# EAGLE schematic sous-vide-shield (EAGLE 7.6.0)
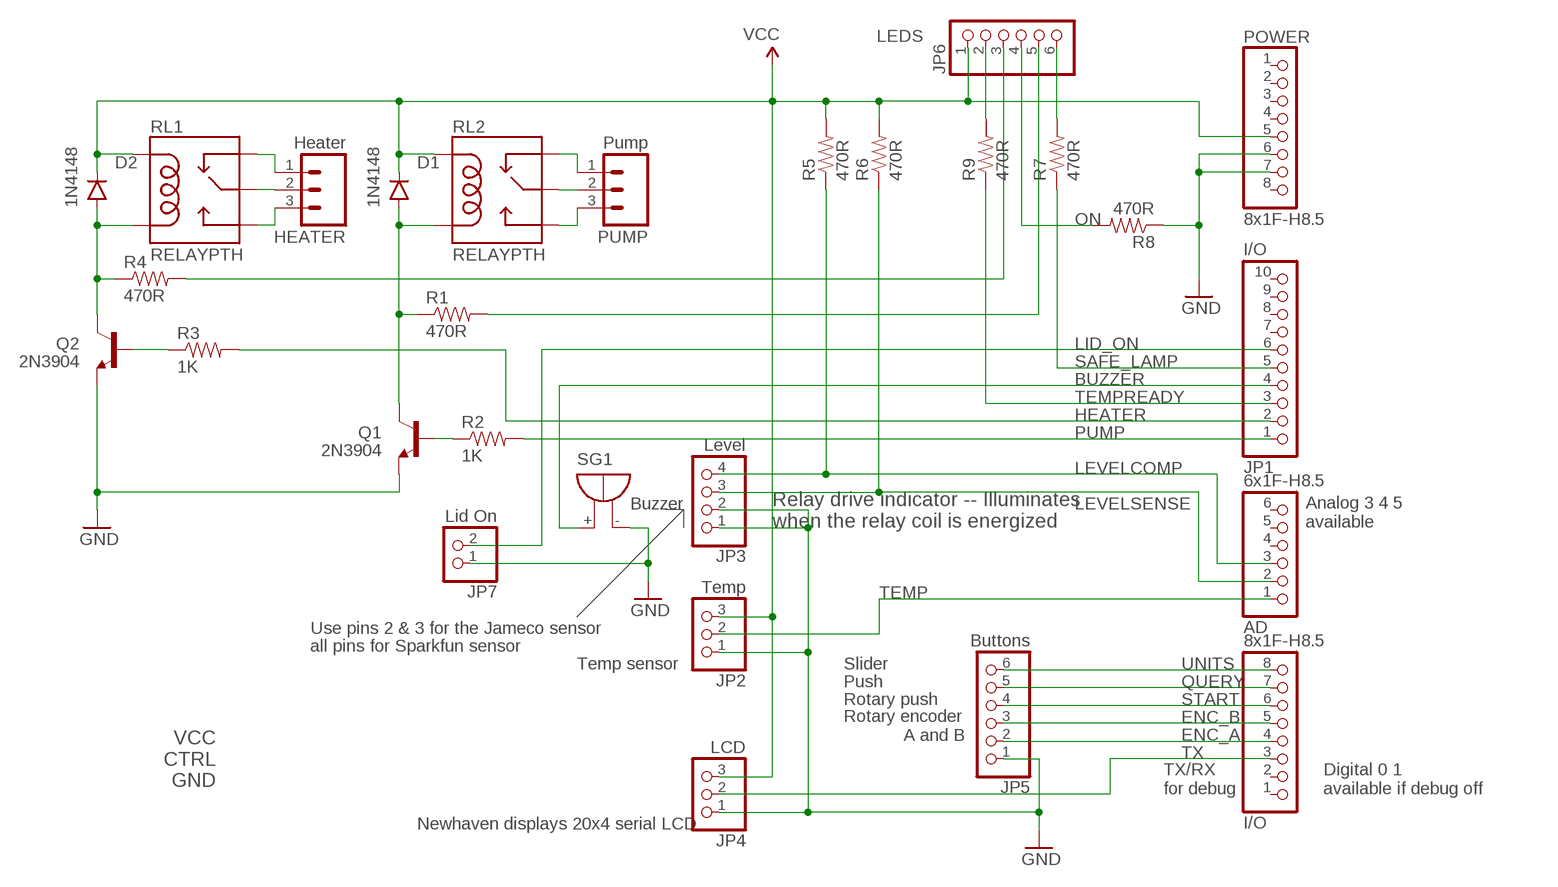
[diagram p0: schematic, sheet 1]

## Parts
AD  6x1F-H8.5  PINHD-1X6  [1X06]
D1  1N4148  DIODEKIT  [DIODE-1N4148-KIT]
D2  1N4148  DIODEKIT  [DIODE-1N4148-KIT]
HEATER  Heater  M03-SCREW-5MM  [SCREWTERMINAL-5MM-3]
I/O  8x1F-H8.5  PINHD-1X8  [1X08]
JP1  I/O  PINHD-1X10  [1X10]
JP2  Temp  PINHD-1X3  [1X03]
JP3  Level  PINHD-1X4  [1X04]
JP4  LCD  PINHD-1X3  [1X03]
JP5  Buttons  PINHD-1X6  [1X06]
JP6  LEDS  PINHD-1X6  [1X06]
JP7  Lid On  PINHD-1X2  [1X02]
POWER  8x1F-H8.5  PINHD-1X8  [1X08]
PUMP  Pump  M03-SCREW-5MM  [SCREWTERMINAL-5MM-3]
Q1  2N3904  TRANSISTOR_NPN2N3904-EZ  [TO-92-EZ]
Q2  2N3904  TRANSISTOR_NPN2N3904-EZ  [TO-92-EZ]
R1  470R  1KOHM-1/4W-1%(PTH)HORIZ-KIT  [AXIAL-0.3EZ]
R2  1K  1KOHM-1/4W-1%(PTH)HORIZ-KIT  [AXIAL-0.3EZ]
R3  1K  1KOHM-1/4W-1%(PTH)HORIZ-KIT  [AXIAL-0.3EZ]
R4  470R  1KOHM-1/4W-1%(PTH)HORIZ-KIT  [AXIAL-0.3EZ]
R5  470R  1KOHM-1/4W-1%(PTH)HORIZ-KIT  [AXIAL-0.3EZ]
R6  470R  1KOHM-1/4W-1%(PTH)HORIZ-KIT  [AXIAL-0.3EZ]
R7  470R  1KOHM-1/4W-1%(PTH)HORIZ-KIT  [AXIAL-0.3EZ]
R8  470R  1KOHM-1/4W-1%(PTH)HORIZ-KIT  [AXIAL-0.3EZ]
R9  470R  1KOHM-1/4W-1%(PTH)HORIZ-KIT  [AXIAL-0.3EZ]
RL1  RELAYPTH  [RELAY-G5Q]
RL2  RELAYPTH  [RELAY-G5Q]
SG1  Buzzer  F/TMB  [F/TMB]

## Nets
BUZZER: JP1.4 SG1.+
COIL: D1.A Q1.3(C) R1.P$1 RL2.1(COIL2)
COIL1: D2.A Q2.3(C) R4.P$1 RL1.1(COIL2)
ENC_A: I/O.4 JP5.2
ENC_B: I/O.5 JP5.3
GND [gnd]: JP2.1 JP3.1 JP3.2 JP4.1 JP5.1 JP7.1 POWER.6 POWER.7 Q1.1(E) Q2.1(E) R8.P$1 SG1.-
HEATER: JP1.2 R3.P$2
LEVELCOMP: AD.3 JP3.4 R5.P$1
LEVELSENSE: AD.2 JP3.3 R6.P$1
LID_ON: JP1.6 JP7.2
N$1: Q2.2(B) R3.P$1
N$2: JP6.3 R4.P$2
N$3: HEATER.2 RL1.2(MAIN)
N$4: HEATER.1 RL1.4(NC)
N$5: PUMP.2 RL2.2(MAIN)
N$6: Q1.2(B) R2.P$1
N$7: HEATER.3 RL1.3(NO)
N$9: JP6.5 R1.P$2
N$10: PUMP.3 RL2.3(NO)
N$11: PUMP.1 RL2.4(NC)
N$12: JP6.6 R7.P$2
N$13: JP6.2 R9.P$2
ON: JP6.4 R8.P$2
PUMP: JP1.1 R2.P$2
QUERY: I/O.7 JP5.5
SAFE_LAMP: JP1.5 R7.P$1
START: I/O.6 JP5.4
TEMP: AD.1 JP2.2
TEMPREADY: JP1.3 R9.P$1
TX: I/O.3 JP4.2
UNITS: I/O.8 JP5.6
VCC: D1.C D2.C JP2.3 JP4.3 JP6.1 POWER.5 R5.P$2 R6.P$2 RL1.5(COIL1) RL2.5(COIL1)
Unconnected: AD.4 AD.5 AD.6 I/O.1 I/O.2 JP1.7 JP1.8 JP1.9 JP1.10 POWER.1 POWER.2 POWER.3 POWER.4 POWER.8

## Notes on the sheet
- Relay drive indicator -- Illuminates
  when the relay coil is energized
- Analog 3 4 5
  available
- Use pins 2 & 3 for the Jameco sensor
- all pins for Sparkfun sensor
- Temp sensor | Slider
- Push
- Rotary push
- Rotary encoder
              A and B
- VCC
  CTRL
  GND
- TX/RX
  for debug
- Digital 0 1
  available if debug off
- Newhaven displays 20x4 serial LCD

## Library data of the parts
AD = SmartPrj:PINHD-1X6: PIN HEADER
D1 D2 = SparkFun-DiscreteSemi:DIODE: Diode These are standard reverse protection diodes and small signal diodes. SMA package can handle up to about 1A. SOD-323 can handle about 200mA. What the SOD-323 package when ordering, there are some mfgs out there that are 5-pin packages.; PROD_ID: DIO-08378
HEATER PUMP = SparkFun-Connectors:M03: Header 3 Standard 3-pin 0.1" header. Use with straight break away headers (SKU : PRT-00116), right angle break away headers (PRT-00553), swiss pins (PRT-00743), machine pins (PRT-00117), and female headers (PRT-00115). Molex polarized connector foot print use with SKU : PRT-08232 with associated crimp pins and housings.; PROD_ID: CONN-10134; STOREFRONT_ID: PRT-08433
I/O POWER = SmartPrj:PINHD-1X8: PIN HEADER
JP1 = pinhead:PINHD-1X10: PIN HEADER
JP2 JP4 = pinhead:PINHD-1X3: PIN HEADER
JP3 = pinhead:PINHD-1X4: PIN HEADER
JP5 JP6 = pinhead:PINHD-1X6: PIN HEADER
JP7 = pinhead:PINHD-1X2: PIN HEADER
Q1 Q2 = SparkFun-DiscreteSemi:TRANSISTOR_NPN: Generic NPN BJT MMBT2222A - TRANS-08049 (SOT-23, 1A 40V) MPSA42 - TRANS-09116 (SOT-23, 500mA 300V) MMBT5088LT1G - TRANS-11160 (SOT-23, 50 mA 30V) BC547 - COM-08928 <http://www.sparkfun.com/products/8928> (TO-92 45V 100mA) (1.Collector 2.Base 3.Emitter) 2N3904 - COM-00521 <http://www.sparkfun.com/products/521> (TO-92 40V 200mA) (1.Emitter 2.Base 3.Collector) P2N2222A - COM-12852 <http://www.sparkfun.com/products/12852> (TO-92 40V 600mA) (1.Collector 2.Base 3.Emitter); PROD_ID: TRANS-08447
R1 R4-R9 = SparkFun-Resistors:1KOHM-1/4W-1%(PTH): RES-12182; PROD_ID: RES-12182; VALUE: 1K
R2 R3 = SparkFun-Resistors:1KOHM-1/4W-1%(PTH): RES-12182; PROD_ID: RES-12182
RL1 RL2 = SparkFun-Electromechanical:RELAY: SPDT relay (COM-00101)
SG1 = buzzer:F/TMB: BUZZER Source: Buerklin; OC_FARNELL: unknown; OC_NEWARK: unknown

## Net classes
1 power: width 0.61 mm, drill 0.61 mm, clearance 0.254 mm
2 gnd: width 0.305 mm, drill 0.559 mm, clearance 0.254 mm
3 usbvcc: width 0.508 mm, drill 0.61 mm, clearance 0.254 mm
4 aref: width 0.406 mm, drill 0.61 mm, clearance 0.254 mm